# EAGLE design IO_Module (EAGLE 9.0.0)
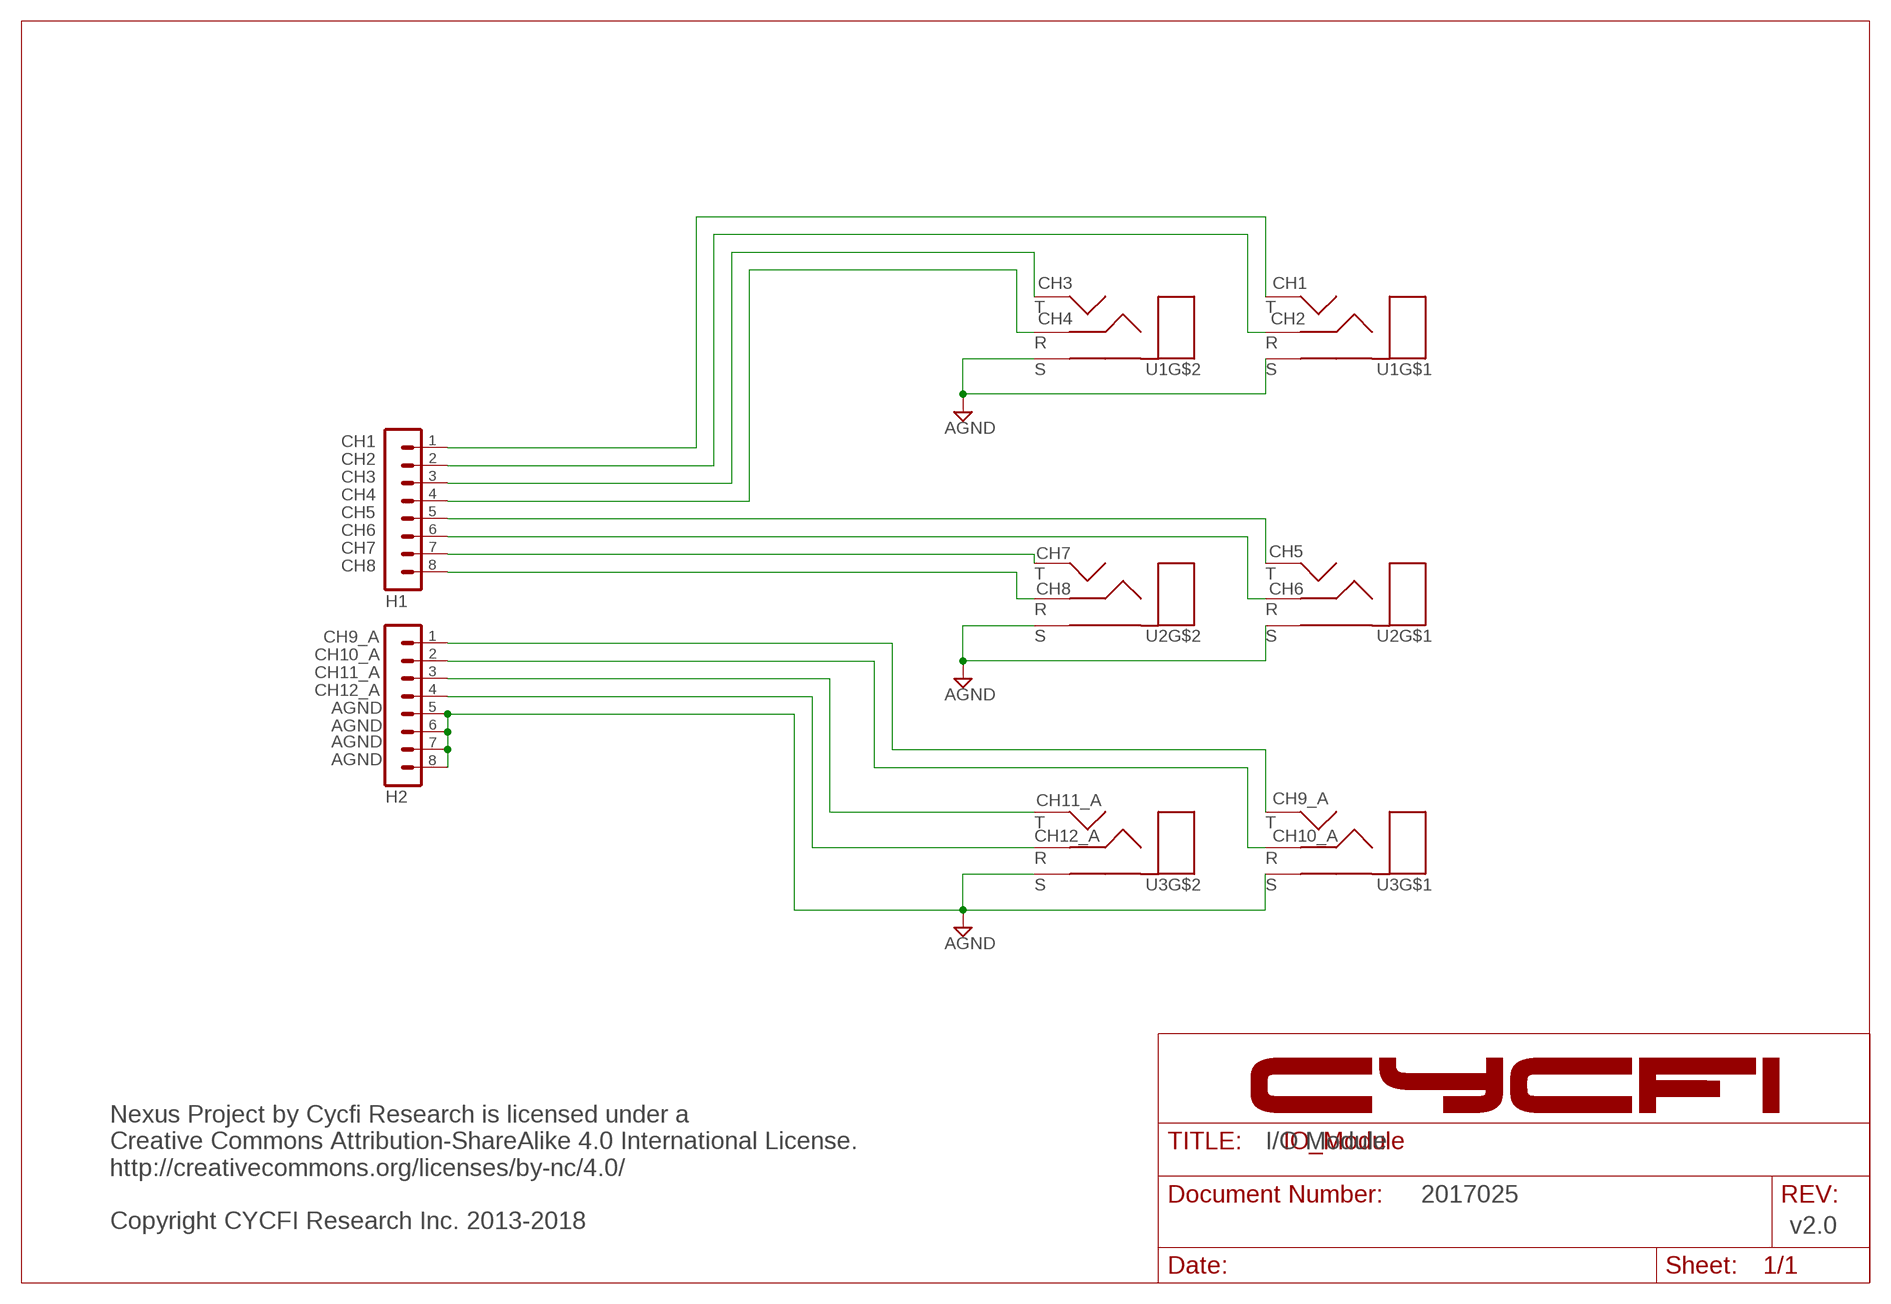
[diagram p0: schematic, sheet 1]

## Parts
H1  MA08-1  [MA08-1]
H2  MA08-1  [MA08-1]
U1  AGND  NSJ12HC  [NSJ12HC]
U2  AGND  NSJ12HC  [NSJ12HC]
U3  AGND  NSJ12HC  [NSJ12HC]

## Nets
AGND: H2.5 H2.6 H2.7 H2.8 U1.G(DGND) U1.SB(S) U1.ST(S) U2.G(DGND) U2.SB(S) U2.ST(S) U3.G(DGND) U3.SB(S) U3.ST(S)
N$1: H1.1 U1.TT(T)
N$2: H1.2 U1.RT(R)
N$3: H1.3 U1.TB(T)
N$4: H1.4 U1.RB(R)
N$5: H1.5 U2.TT(T)
N$6: H1.6 U2.RT(R)
N$7: H1.7 U2.TB(T)
N$8: H1.8 U2.RB(R)
N$9: H2.1 U3.TT(T)
N$10: H2.2 U3.RT(R)
N$11: H2.3 U3.TB(T)
N$12: H2.4 U3.RB(R)

## Notes on the sheet
- CH3 | CH1
- CH4 | CH2
- CH1
- CH2
- CH3
- CH4
- CH5
- CH6
- CH7 | CH5
- CH7
- CH8
- CH8 | CH6
- CH9_A
- CH10_A
- CH11_A
- CH12_A
- CH11_A | CH9_A
- CH12_A | CH10_A
- I/O Module
- 2017025
- Nexus Project by Cycfi Research is licensed under a 
  Creative Commons Attribution-ShareAlike 4.0 International License. 
  http://creativecommons.org/licenses/by-nc/4.0/
  
  Copyright CYCFI Research Inc. 2013-2018
- v2.0

## Library data of the parts
H1 H2 = con-lstb:MA08-1: PIN HEADER; OC_FARNELL: unknown; OC_NEWARK: unknown
U1-U3 = CYCFI_Jack:NSJ12HC

## Board
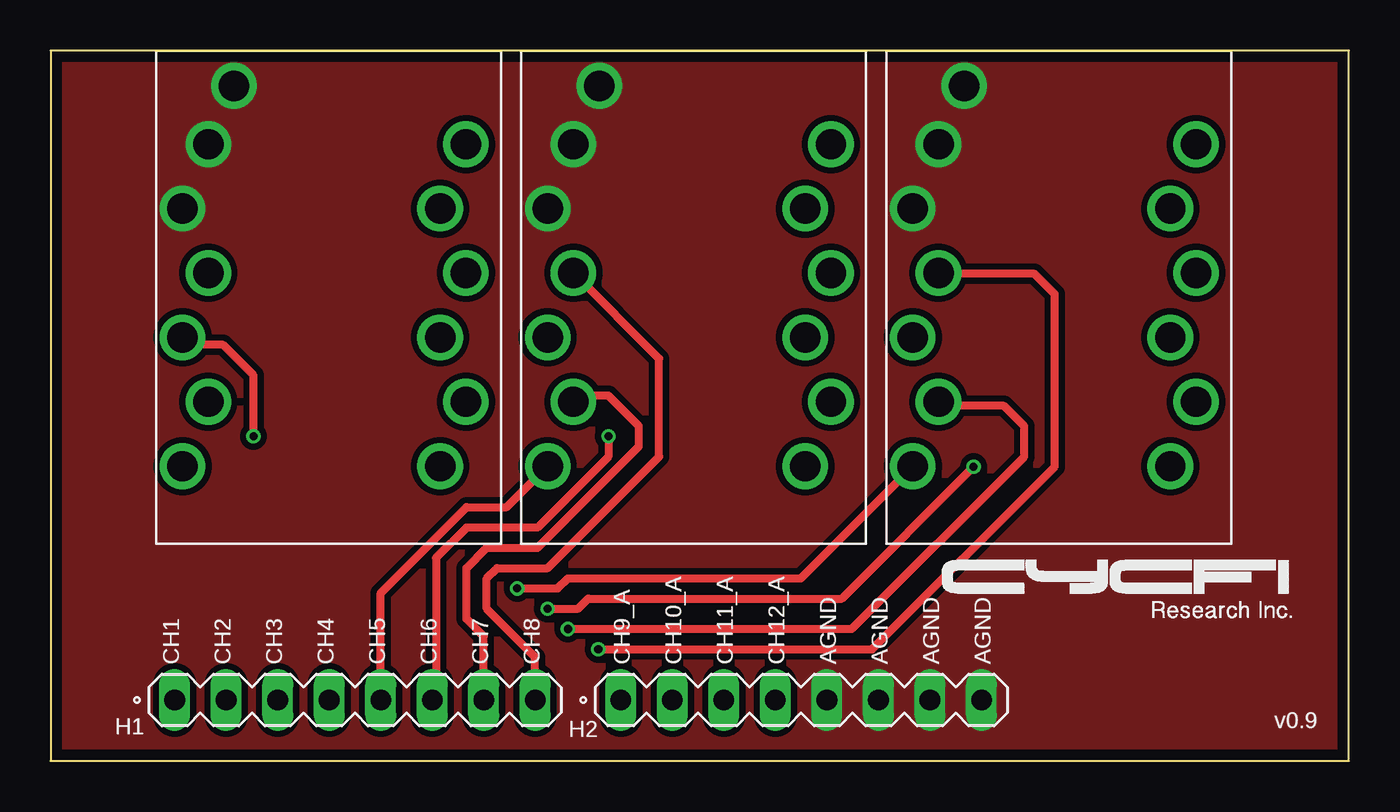
[diagram p1: board, top side]
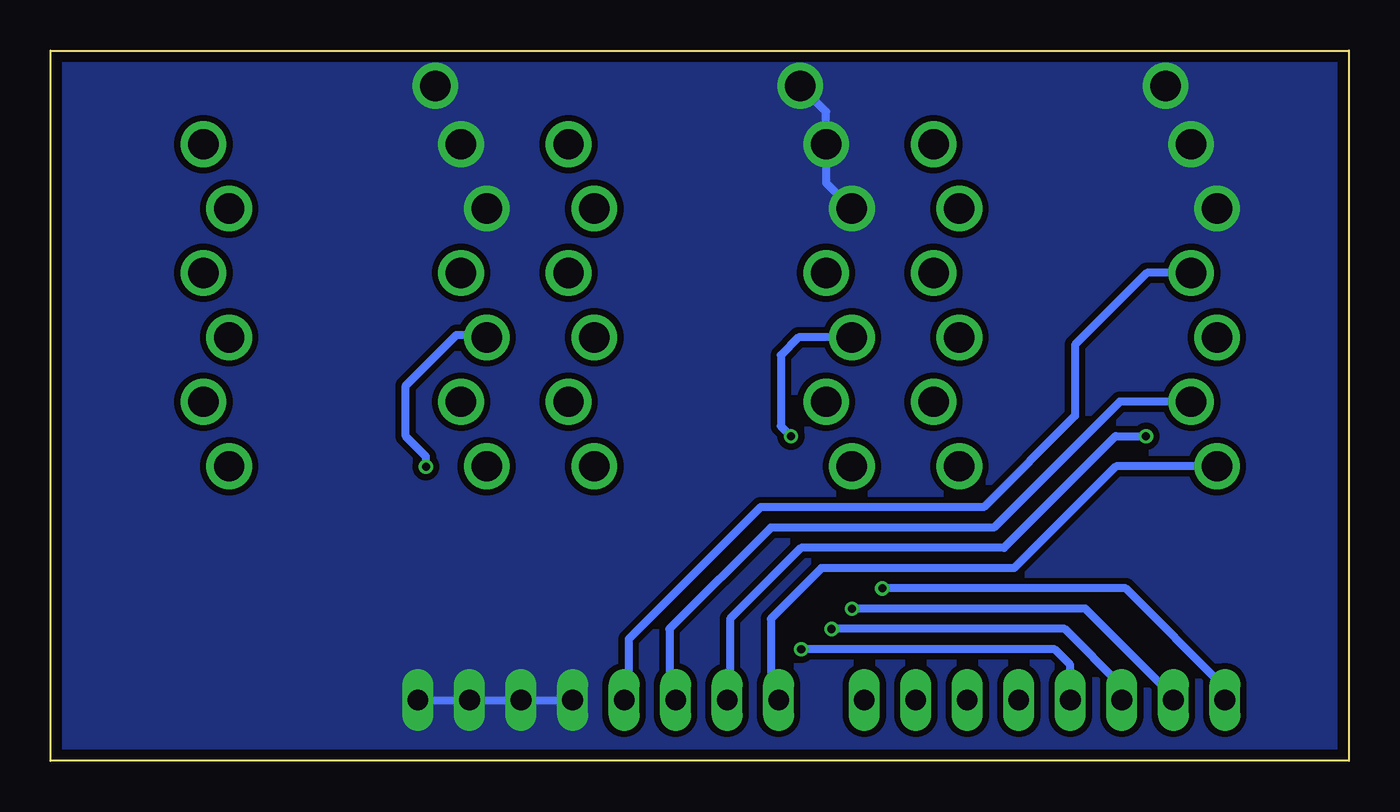
[diagram p2: board, bottom side, seen from below]

Size 64 x 35 mm. Coordinates in mm from the lower left corner, seen from the top.
Outline: 0,0 64,0 64,35 0,35 0,0
Copper layers (1*16): Top 0.035mm / dielectric 1.6mm / Bottom 0.035mm
Design rules "Elecrow_2-layer_PCB_eagle_rule": minimum track width 6mil, minimum drill 12mil, track to track 6mil, track to pad 8mil, pad to pad 12mil, via to via 12mil, smd to smd 0mil, copper to edge 20mil, drill to drill 10mil, minimum pad ring 6mil, minimum via ring 6mil, stop-mask expansion 0mil, vias tented up to drill 100mil, thermal gap 10mil

### Footprints (pad centres in the part's own frame; a part is rotated, then mirrored left to right if it is on the bottom)
MA08-1 = drill 1.016 long: 1 -8.89,0; 2 -6.35,0; 3 -3.81,0; 4 -1.27,0; 5 1.27,0; 6 3.81,0; 7 6.35,0; 8 8.89,0
NSJ12HC = drill 1.5: G -1.73,5.96; RB -10.95,7.23; RNB -10.95,-5.47; RNT -14.13,-4.2; RT -14.13,8.5; SB -4.61,7.23; SNB -4.61,-5.47; SNT -7.78,-4.2; ST -7.78,8.5; TB -17.3,7.23; TNB -17.3,-5.47; TNT -20.48,-4.2; TT -20.48,8.5

### Placement (x,y rotation side)
H1  15,3 0 top
H2  37,3 0 top
U1  51,35 90 top
U2  33,35 90 top
U3  15,35 90 top

### Tracks (layer width: path | path; a pad name or v marks a point on that pad's centre or on a via)
AGND
  Bottom 0.406: H2.8 H2.7 H2.6 H2.5 | U2.G 25.77,32 U2.SB 25.77,28.49 U2.ST
  pour Top (isolate 0.305, no thermals): 0,0 0,34.92 64.14,34.92 64.14,0
  pour Bottom (isolate 0.305, no thermals): 0,0 63.82,0 63.82,34.92 0,34.92
N$1  (via drill 0.4)
  Top 0.406: v23,8.5 25,8.5 25.5,9 36.98,9 U1.TT
  Bottom 0.406: H1.1 6.11,3.61 11,8.5 v23,8.5
N$2  (via drill 0.4)
  Top 0.406: v45.5,14.5 39,8 26.5,8 26,7.5 v24.5,7.5
  Bottom 0.406: H1.2 8.65,3.15 13,7.5 v24.5,7.5 | v45.5,14.5 45.5,15 46.5,16 46.5,18.5 44,21 42.63,21 U1.RT
N$3  (via drill 0.4)
  Top 0.406: v25.5,6.5 39.5,6.5 48,15 48,16.5 47,17.5 43.97,17.5 U1.TB
  Bottom 0.406: H1.3 11.19,3.69 14,6.5 v25.5,6.5
N$4  (via drill 0.4)
  Top 0.406: v27,5.5 40.5,5.5 49.5,14.5 49.5,23 48.5,24 43.82,24 U1.RB
  Bottom 0.406: H1.4 13.73,4.73 14.5,5.5 v27,5.5
N$5
  Top 0.406: H1.5 16.27,8.27 20.5,12.5 22.48,12.5 U2.TT
N$6  (via drill 0.4)
  Top 0.406: H1.6 19,3.19 19,10 20.5,11.5 24,11.5 27.5,15 v27.5,16
  Bottom 0.406: U2.RT 27.13,20.87 28,20 28,16.5 v27.5,16
N$7
  Top 0.406: H1.7 21.35,6.15 20.5,7 20.5,9.5 21.5,10.5 24,10.5 29,15.5 29,16.5 27.5,18 26.07,18 U2.TB
N$8
  Top 0.406: H1.8 23.89,5.11 21.5,7.5 21.5,9 22,9.5 24.5,9.5 30,15 30,19.82 U2.RB
N$9
  Bottom 0.406: U3.TT 11.48,14.52 16.5,9.5 26,9.5 28.5,7 28.5,3.39 H2.1
N$10  (via drill 0.4)
  Top 0.406: v10,16 10,19 8.5,20.5 6.87,20.5 U3.RT
  Bottom 0.406: H2.2 30.5,3.15 30.5,7 27,10.5 17,10.5 11.5,16 v10,16
N$11
  Bottom 0.406: U3.TB 11.3,17.7 17.5,11.5 28.5,11.5 33.5,6.5 33.5,3.31 H2.3
N$12
  Bottom 0.406: U3.RB 9.95,24.05 13.5,20.5 13.5,17 18,12.5 29,12.5 35.5,6 35.5,3.23 H2.4

### Text on the board
tNames: CH1 | CH2 | CH3 | CH4 | CH5 | CH6 | CH7 | CH8 | CH9_A | CH10_A | CH11_A | CH12_A | AGND | AGND | AGND | AGND | v0.9
_tNames: CH1 | CH2 | CH3 | CH4 | CH5 | CH6 | CH7 | CH8 | CH9_A | CH10_A | CH11_A | CH12_A | AGND | AGND | AGND | AGND | v0.9 | H1 | H2